# EAGLE design board (EAGLE 9.3.0)
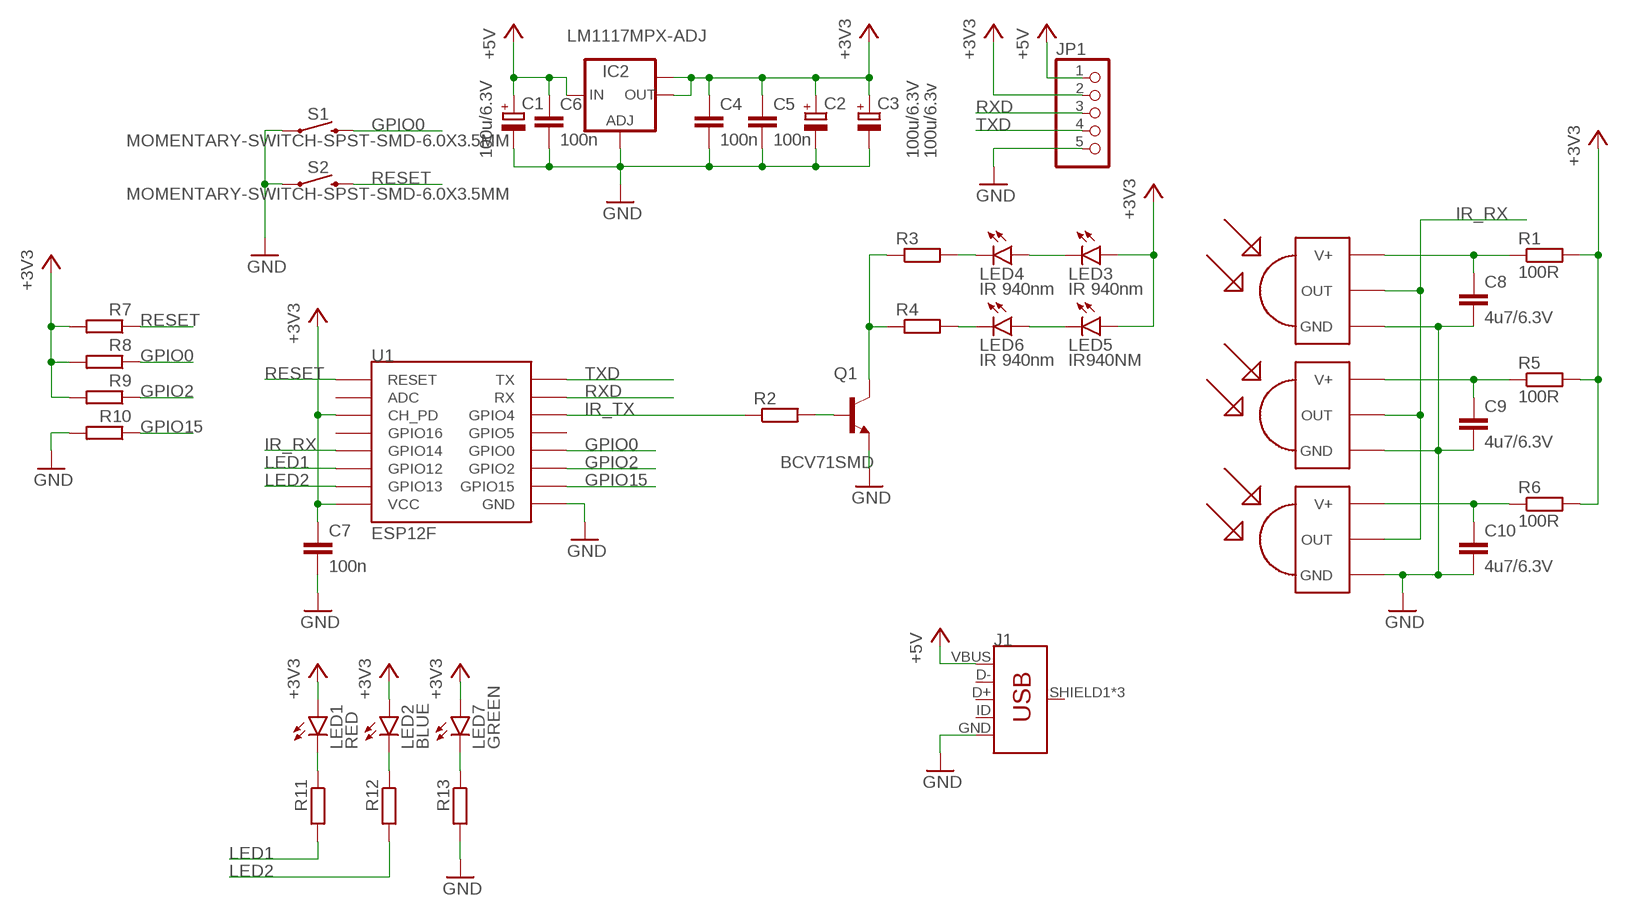
[diagram p0: schematic, sheet 1]

## Parts
C1  100u/6.3V  CPOL-EU153CLV-0605  [153CLV-0605]
C2  100u/6.3V  CPOL-EU153CLV-0605  [153CLV-0605]
C3  100u/6.3v  CPOL-EU153CLV-0605  [153CLV-0605]
C4  100n  C-EUC0805  [C0805]
C5  100n  C-EUC0805  [C0805]
C6  100n  C-EUC0805  [C0805]
C7  100n  C-EUC0805  [C0805]
C8  4u7/6.3V  C-EUC0805  [C0805]
C9  4u7/6.3V  C-EUC0805  [C0805]
C10  4u7/6.3V  C-EUC0805  [C0805]
IC2  LM1117MPX-ADJ  [SOT223]
J1  USB_MICRO-B_FEMALE-SMT  [USB-B-MICRO-SMD]
JP1  PINHD-1X5  [1X05]
LED1  RED  LEDCHIPLED_0805  [CHIPLED_0805]
LED2  BLUE  LEDCHIPLED_0805  [CHIPLED_0805]
LED3  IR 940nm  LED5MM  [LED5MM]
LED4  IR 940nm  LED5MM  [LED5MM]
LED5  IR940NM  LED5MM  [LED5MM]
LED6  IR 940nm  LED5MM  [LED5MM]
LED7  GREEN  LEDCHIPLED_0805  [CHIPLED_0805]
Q1  BCV71SMD  [SOT23-BEC]
R1  100R  R-EU_M0805  [M0805]
R2  R-EU_M0805  [M0805]
R3  R-EU_M0805  [M0805]
R4  R-EU_M0805  [M0805]
R5  100R  R-EU_M0805  [M0805]
R6  100R  R-EU_M0805  [M0805]
R7  R-EU_M0805  [M0805]
R8  R-EU_M0805  [M0805]
R9  R-EU_M0805  [M0805]
R10  R-EU_M0805  [M0805]
R11  R-EU_M0805  [M0805]
R12  R-EU_M0805  [M0805]
R13  R-EU_M0805  [M0805]
S1  MOMENTARY-SWITCH-SPST-SMD-6.0X3.5MM  [TACTILE_SWITCH_SMD_6.0X3.5MM]
S2  MOMENTARY-SWITCH-SPST-SMD-6.0X3.5MM  [TACTILE_SWITCH_SMD_6.0X3.5MM]
U1  ESP12F  ESP12SMD  [ESP12-SMD]
U$1  TSOP4838  [TSOP18XX]
U$2  TSOP4838  [TSOP18XX]
U$3  TSOP4838  [TSOP18XX]

## Nets
+3V3: C2.+ C3.+ C4.1 C5.1 C7.1 IC2.2(OUT) IC2.TAB(OUT1) JP1.2 LED1.A LED2.A LED3.A LED5.A LED7.A R1.2 R5.2 R6.2 R7.2 R8.2 R9.2 U1.CH_PD U1.VCC
+5V: C1.+ C6.1 IC2.3(IN) J1.VBUS JP1.1
GND: C1.- C2.- C3.- C4.2 C5.2 C6.2 C7.2 C8.2 C9.2 C10.2 IC2.1(ADJ) J1.GND JP1.5 Q1.E R10.2 R13.2 S1.1 S2.1 U1.GND U$1.GND U$2.GND U$3.GND
GPIO0: R8.1 S1.2 U1.GPIO0
GPIO2: R9.1 U1.GPIO2
GPIO15: R10.1 U1.GPIO15
IR_RX: U1.GPIO14 U$1.OUT U$2.OUT U$3.OUT
IR_TX: R2.1 U1.GPIO4
LED1: R11.2 U1.GPIO12
LED2: R12.2 U1.GPIO13
N$1: LED3.K(C) LED4.A
N$2: LED5.K(C) LED6.A
N$3: C9.1 R5.1 U$2.VCC(V+)
N$4: C8.1 R1.1 U$1.VCC(V+)
N$5: Q1.C R3.1 R4.1
N$6: C10.1 R6.1 U$3.VCC(V+)
N$7: LED7.C R13.1
N$8: Q1.B R2.2
N$9: LED2.C R12.1
N$11: LED4.K(C) R3.2
N$12: LED6.K(C) R4.2
N$14: LED1.C R11.1
RESET: R7.1 S2.2 U1.RESET
RXD: JP1.3 U1.RXD0(RX)
TXD: JP1.4 U1.TXD0(TX)
Unconnected: J1.D+ J1.D- J1.ID J1.SHIELD1(SHIELD) J1.SHIELD2(SHIELD) J1.SHIELD3(SHIELD) U1.ADC U1.GPIO5 U1.GPIO16

## Library data of the parts
C1-C3 = rcl:CPOL-EU: POLARIZED CAPACITOR, European symbol; SPICEPREFIX: C
C4-C10 = rcl:C-EU: CAPACITOR, European symbol; SPICEPREFIX: C
IC2 = lm1117:LM1117MPX-ADJ
J1 = SparkFun-Connectors:USB_MICRO-B: USB Type Micro-B Connector Male/female and PTH/SMT variants SparkFun Products: SparkFun microB USB Breakout <https://www.sparkfun.com/products/12035> SparkFun USB microB Plug Breakout <https://www.sparkfun.com/products/10031> SparkFun ESP8266 Thing <https://www.sparkfun.com/products/13231>; PROD_ID: CONN-11752
JP1 = pinhead:PINHD-1X5: PIN HEADER
LED1-LED7 = led:LED: LED OSRAM: - CHIPLED LG R971, LG N971, LY N971, LG Q971, LY Q971, LO R971, LY R971 LH N974, LH R974 LS Q976, LO Q976, LY Q976 LO Q996 - Hyper CHIPLED LW Q18S LB Q993, LB Q99A, LB R99A - SideLED LS A670, LO A670, LY A670, LG A670, LP A670 LB A673, LV A673, LT A673, LW A673 LH A674 LY A675 LS A676, LA A676, LO A676, LY A676, LW A676 LS A679, LY A679, LG A679 - Hyper Micro SIDELED® LS Y876, LA Y876, LO Y876, LY Y876 LT Y87S - SmartLED LW L88C, LW L88S LB L89C, LB L89S, LG L890 LS L89K, LO L89K, LY L89K LS L896, LA L896, LO L896, LY L896 - TOPLED LS T670, LO T670, LY T670, LG T670, LP T670 LSG T670, LSP T670, LSY T670, LOP T670, LYG T670 LG T671, LOG T671, LSG T671 LB T673, LV T673, LT T673, LW T673 LH T674 LS T676, LA T676, LO T676, LY T676, LB T676, LH T676, LSB T676, LW T676 LB T67C, LV T67C, LT T67C, LS T67K, LO T67K, LY T67K, LW E67C LS E67B, LA E67B, LO E67B, LY E67B, LB E67C, LV E67C, LT E67C LW T67C LS T679, LY T679, LG T679 LS T770, LO T770, LY T770, LG T770, LP T770 LB T773, LV T773, LT T773, LW T773 LH T774 LS E675, LA E675, LY E675, LS T675 LS T776, LA T776, LO T776, LY T776, LB T776 LHGB T686 LT T68C, LB T68C - Hyper Mini TOPLED® LB M676 - Mini TOPLED Santana® LG M470 LS M47K, LO M47K, LY M47K Source: http://www.osram.convergy.de LUXEON: - LUMILED® LXK2-PW12-R00, LXK2-PW12-S00, LXK2-PW14-U00, LXK2-PW14-V00 LXK2-PM12-R00, LXK2-PM12-S00, LXK2-PM14-U00 LXK2-PE12-Q00, LXK2-PE12-R00, LXK2-PE12-S00, LXK2-PE14-T00, LXK2-PE14-U00 LXK2-PB12-K00, LXK2-PB12-L00, LXK2-PB12-M00, LXK2-PB14-N00, LXK2-PB14-P00, LXK2-PB14-Q00 LXK2-PR12-L00, LXK2-PR12-M00, LXK2-PR14-Q00, LXK2-PR14-R00 LXK2-PD12-Q00, LXK2-PD12-R00, LXK2-PD12-S00 LXK2-PH12-R00, LXK2-PH12-S00 LXK2-PL12-P00, LXK2-PL12-Q00, LXK2-PL12-R00 Source: www.luxeon.com KINGBRIGHT: KA-3528ASYC Source: www.kingbright.com
Q1 = transistor-npn:BCV71*: NPN Transistor
R1-R13 = rcl:R-EU_: RESISTOR, European symbol; SPICEPREFIX: R
S1 S2 = SparkFun-Switches:MOMENTARY-SWITCH-SPST: Momentary Switch (Pushbutton) - SPST Normally-open (NO) SPST momentary switches (buttons, pushbuttons). Variants PTH-12MM - 12mm square, through-hole Momentary Pushbutton Switch - 12mm Square <https://www.sparkfun.com/products/9190> (COM-09190) PTH-6.0MM, PTH-6.0MM-KIT - 6.0mm square, through-hole Mini Pushbutton Switch <https://www.sparkfun.com/products/97> (COM-00097) KIT package intended for soldering kit's - only one side of pads' copper is exposed. PTH-RIGHT-ANGLE-KIT - Right-angle, through-hole Right Angle Tactile Button <https://www.sparkfun.com/products/10791> - Used on SparkFun BigTime Watch Kit <https://www.sparkfun.com/products/11734> SMD-12MM - 12mm square, surface-mount Tactile Button - SMD (12mm) <https://www.sparkfun.com/products/12993> (COM-12993) Used on SparkFun PicoBoard <https://www.sparkfun.com/products/11888> SMD-4.5MM - 4.5mm Square Trackball Switch Used on SparkFun Blackberry Trackballer Breakout <https://www.sparkfun.com/products/13169> SMD-4.6MMX2.8MM - 4.60mm x 2.80mm, surface mount Used on SparkFun SAMD21 Mini Breakout <https://www.sparkfun.com/products/13664> SMD-5.2MM, SMD-5.2-REDUNDANT - 5.2mm square, surface-mount Mini Pushbutton Switch - SMD <https://www.sparkfun.com/products/8720> (COM-08720) Used on Arduino Pro Mini <https://www.sparkfun.com/products/11114> REDUNDANT package connects both switch circuits together SMD-6.0X3.5MM - 6.0 x 3.5mm, surface mount Momentary Reset Switch SMD <https://www.sparkfun.com/products/8229> (COM-08229) SMD-6.2MM-TALL - 6.2mm square, surface mount Tactile Button - SMD (6mm) <https://www.sparkfun.com/products/12992> Used on SparkFun Digital Sandbox <https://www.sparkfun.com/products/12651> SMD-RIGHT-ANGLE - Right-angle, surface mount Used on SparkFun Block for Intel® Edison - Arduino <https://www.sparkfun.com/products/13036>; PROD_ID: SWCH-00815; SF_SKU: COM-08229
U1 = esp8266modules:ESP12: ESP8266 Wifi module 12
U$1-U$3 = tsop:TSOP4838: IR Receiver and Demodulator

## Board
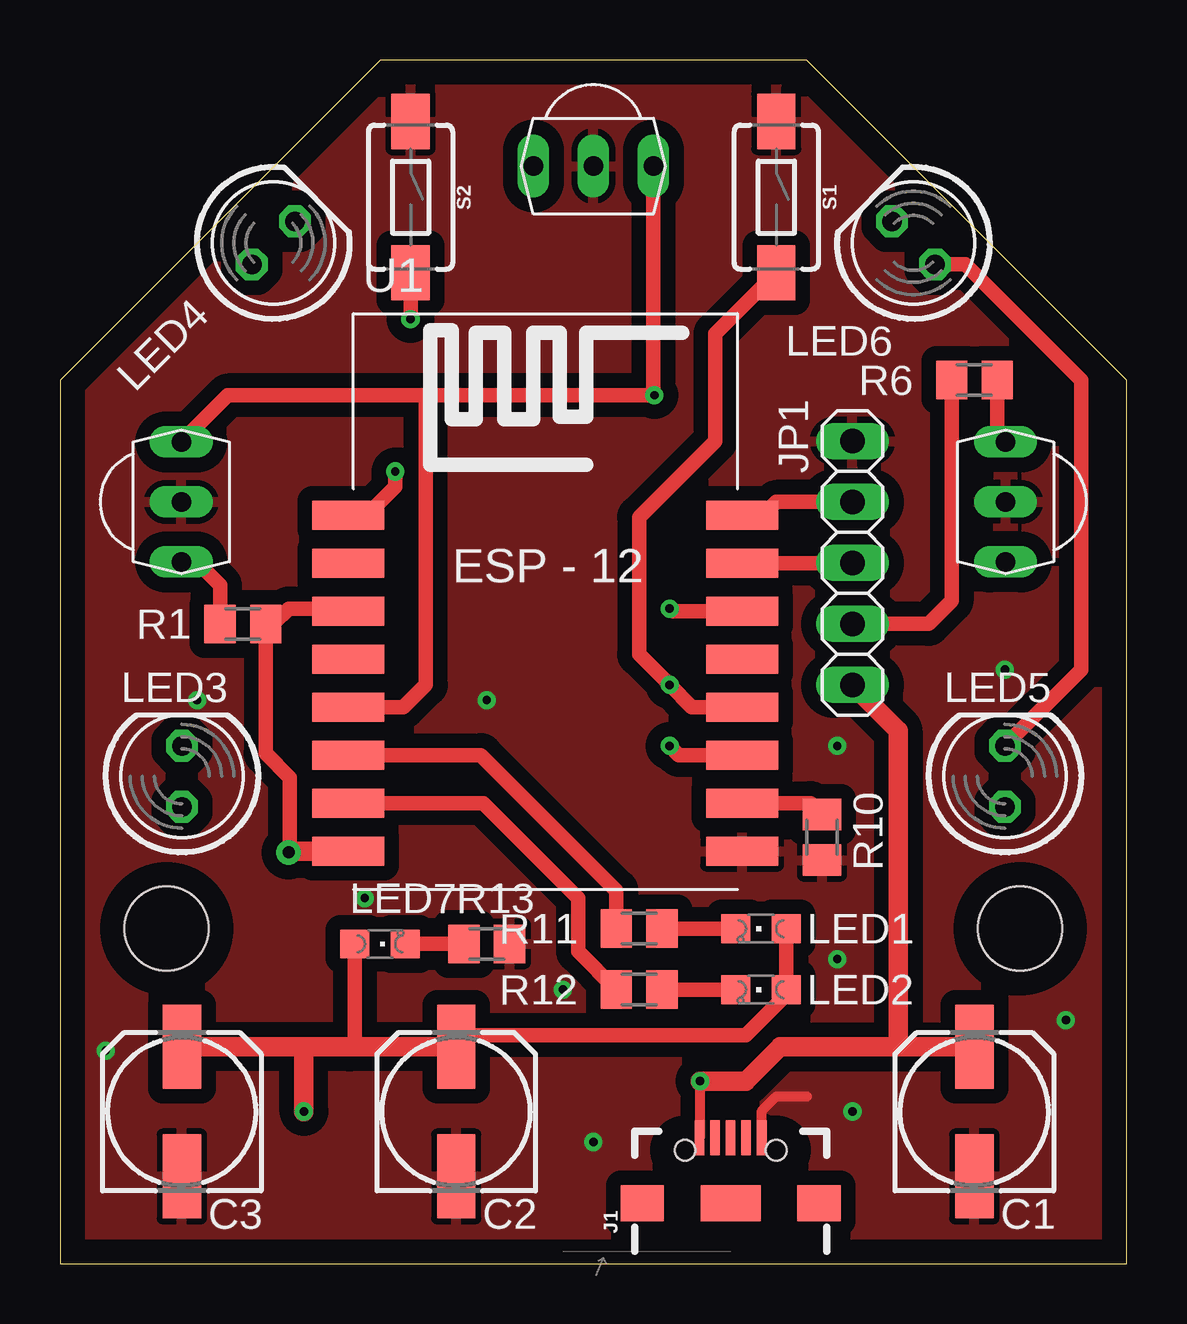
[diagram p1: board, top side]
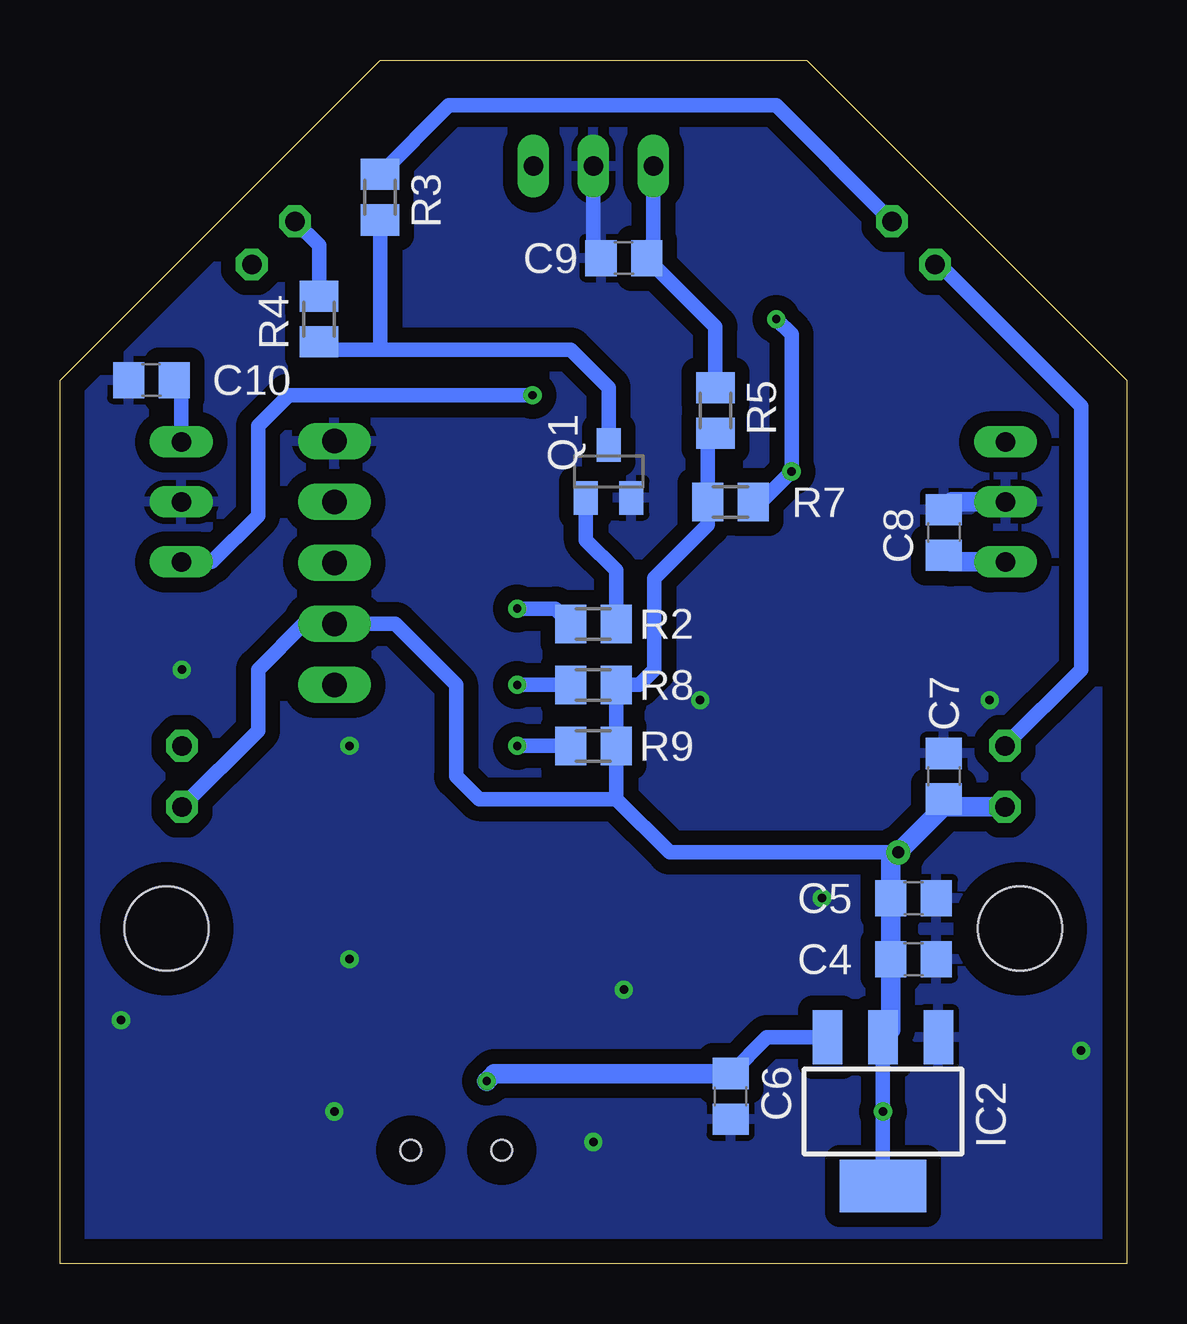
[diagram p2: board, bottom side, seen from below]

Size 44.45 x 50.16 mm. Coordinates in mm from the lower left corner, seen from the top.
Outline: 0,0 44.45,0 44.45,36.83 31.11,50.16 13.34,50.16 0,36.83 0,0
Copper layers (1*16): Top 0.0347mm / dielectric 1.5306mm / Bottom 0.0347mm
Design rules "AllPCB": minimum track width 6mil, minimum drill 0.3mm, track to track 6mil, track to pad 6mil, pad to pad 6mil, via to via 6mil, smd to smd 6mil, copper to edge 40mil, drill to drill 8mil, minimum pad ring 10mil, minimum via ring 8mil, stop-mask expansion 4mil, vias tented up to drill 0mil, thermal gap 10mil
Holes 3.5 mm at 4.45,13.97 40.01,13.97

### Footprints (pad centres in the part's own frame; a part is rotated, then mirrored left to right if it is on the bottom)
153CLV-0605 = smd 3.5 x 1.6: + 2.7,0; - -2.7,0
C0805 = smd 1.3 x 1.5: 1 -0.95,0; 2 0.95,0
SOT223 = smd 1.219 x 2.235: 1 -2.311,-3.099; 2 0,-3.099; 3 2.311,-3.099 | smd 3.6 x 2.2: TAB 0,3.099
USB-B-MICRO-SMD = smd 1.45 x 0.4: D+ 2.725,0; D- 2.725,0.65; GND 2.725,-1.3; ID 2.725,-0.65; VBUS 2.725,1.3 | smd 1.5 x 1.8: SHIELD1 0,3.685; SHIELD2 0,-3.685 | smd 1.5 x 2.5: SHIELD3 0,0 | hole 0.85: 2.2,1.9; 2.2,-1.9
1X05 = drill 1.016 long: 1 -5.08,0; 2 -2.54,0; 3 0,0; 4 2.54,0; 5 5.08,0
CHIPLED_0805 = smd 1.2 x 1.2: A 0,-1.05; C 0,1.05
LED5MM = drill 0.813 octagon: A -1.27,0; K 1.27,0
SOT23-BEC = smd 1 x 1.4: B -0.95,-1.1; C 0,1.1; E 0.95,-1.1
M0805 = smd 1.3 x 1.6: 1 -0.95,0; 2 0.95,0
TACTILE_SWITCH_SMD_6.0X3.5MM = smd 2.3 x 1.6: 1 -3.15,0; 2 3.15,0
ESP12-SMD = smd 3 x 1.2: ADC -8.3,3.8; CH_PD -8.3,1.8; GND 8.1,-8.2; GPIO0 8.1,-2.2; GPIO2 8.1,-4.2; GPIO4 8.1,1.8; GPIO5 8.1,-0.2; GPIO12 -8.3,-4.2; GPIO13 -8.3,-6.2; GPIO14 -8.3,-2.2; GPIO15 8.1,-6.2; GPIO16 -8.3,-0.2; RESET -8.3,5.8; RXD0 8.1,3.8; TXD0 8.1,5.8; VCC -8.3,-8.2
TSOP18XX = drill 0.813 long: GND -0.001,-0.027; OUT -2.501,-0.027; VCC 2.499,-0.027

### Placement (x,y rotation side)
C1  38.1,6.35 90 top
C2  16.51,6.35 90 top
C3  5.08,6.35 90 top
C4  8.89,12.7 0 bottom
C5  8.89,15.24 0 bottom
C6  16.51,6.99 270 bottom
C7  7.62,20.32 90 bottom
C8  7.62,30.48 90 bottom
C9  20.95,41.91 180 bottom
C10  40.64,36.83 180 bottom
IC2  10.16,6.35 180 bottom
J1  27.94,2.54 90 top
JP1  33.02,29.21 90 top
LED1  29.21,13.97 90 top
LED2  29.21,11.43 90 top
LED3  5.08,20.32 90 top
LED4  8.89,42.54 45 top
LED5  39.37,20.32 90 top
LED6  35.56,42.54 135 top
LED7  13.34,13.34 270 top
Q1  21.59,33.02 0 bottom
R1  7.62,26.67 0 top
R2  22.23,26.67 0 bottom
R3  31.11,44.45 90 bottom
R4  33.66,39.37 90 bottom
R5  17.14,35.56 270 bottom
R6  38.1,36.83 180 top
R7  16.51,31.75 180 bottom
R8  22.23,24.13 0 bottom
R9  22.23,21.59 0 bottom
R10  31.75,17.78 270 top
R11  24.13,13.97 180 top
R12  24.13,11.43 180 top
R13  17.78,13.34 0 top
S1  29.84,44.45 270 top
S2  14.61,44.45 270 top
U1  20.32,25.4 0 top
U$1  5.08,31.75 270 top
U$2  22.23,45.72 180 top
U$3  39.37,31.75 90 top

### Tracks (layer width: path | path; a pad name or v marks a point on that pad's centre or on a via)
+3V3  (via drill 0.35, 0.5 pad 1.02)
  Top 0.61: v9.53,17.14 9.58,17.2 9.58,20.26 8.57,21.27 R1.2 8.89,26.67 9.53,27.3 11.91,27.3 U1.CH_PD | LED1.A LED2.A 30.26,11.21 28.57,9.53 16.98,9.53 C2.+ | R6.2 37.15,27.62 36.2,26.67 JP1.2 | LED7.A 12.29,9.27 12.06,9.05
  Top 0.813: U1.VCC 9.58,17.2 | C2.+ 12.06,9.05 10.16,9.05 | 10.16,9.05 C3.+ | v10.16,6.35 10.16,9.05
  Bottom 0.61: IC2.2 v10.16,6.35 IC2.TAB | 21.27,19.37 R9.2 R8.2 20.32,24.13 19.68,24.77 19.68,28.57 17.46,30.8 R7.2 17.46,34.29 R5.2 | v9.53,17.14 19.05,17.14 21.27,19.37 | 21.27,19.37 26.99,19.37 27.94,20.32 27.94,24.13 30.48,26.67 JP1.2 34.29,26.67 36.2,24.77 36.2,22.23 LED5.A
  Bottom 0.813: IC2.2 9.84,9.77 C4.1 C5.1 9.84,16.83 v9.53,17.14 7.62,19.05 | 7.62,19.05 LED3.A | C7.1 7.62,19.05
+5V  (via drill 0.35)
  Top 0.406: J1.VBUS 26.67,5.29 v26.67,7.62
  Top 0.813: JP1.1 34.92,22.23 34.92,9.05 | v26.67,7.62 28.57,7.62 30,9.05 34.92,9.05 | 34.92,9.05 C1.+
  Bottom 0.61: IC2.3 15,9.45 C6.1
  Bottom 0.813: C6.1 26.36,7.94 v26.67,7.62
GND  (via drill 0.35)
  Top 0.406: J1.GND 29.24,6.38 29.84,6.99 31.11,6.99
  Bottom 0.61: U$2.GND 22.23,42.23 C9.2
  Bottom 0.813: U$1.GND 7.3,31.75 C8.2
  other vias: 17.78,23.5 5.71,23.5 12.7,15.24 20.95,11.43 1.91,8.89 22.23,5.08 32.38,12.7 32.38,21.59 39.37,24.77 41.91,10.16 33.02,6.35
  pour Top (isolate 0.61): 0,50.16 44.45,50.16 44.45,-1.27 0,-1.27
  pour Bottom (isolate 0.61): 0,50.16 44.45,50.16 44.45,-1.27 0,-1.27
GPIO0  (via drill 0.35)
  Top 0.61: U1.GPIO0 26.33,23.2 v25.4,24.13 24.13,25.4 24.13,31.11 27.3,34.29 27.3,38.76 S1.2
  Bottom 0.61: v25.4,24.13 R8.1
GPIO2  (via drill 0.35)
  Top 0.61: U1.GPIO2 25.79,21.2 v25.4,21.59
  Bottom 0.61: v25.4,21.59 R9.1
GPIO15
  Top 0.61: U1.GPIO15 31.28,19.2 R10.1
IR_RX  (via drill 0.35)
  Top 0.61: U$1.OUT 7,36.2 15.24,36.2 | 15.24,36.2 v24.77,36.2 24.73,36.23 U$2.OUT | U1.GPIO14 14.31,23.2 15.24,24.13 15.24,36.2
  Bottom 0.61: U$3.OUT 38.13,29.25 36.2,31.18 36.2,34.92 34.92,36.2 v24.77,36.2
IR_TX  (via drill 0.35)
  Top 0.61: U1.GPIO4 25.5,27.2 v25.4,27.3
  Bottom 0.61: v25.4,27.3 23.81,27.3 R2.1
LED1
  Top 0.61: U1.GPIO12 17.54,21.2 23.18,15.55 R11.2
LED2
  Top 0.61: R12.2 21.59,13.02 21.59,15.24 17.63,19.2 U1.GPIO13
N$1
  Bottom 0.61: LED3.K 1.91,24.77 1.91,35.73 7.82,41.65 LED4.A
N$2
  Top 0.61: LED5.K 42.55,24.77 42.55,36.83 37.73,41.65 LED6.A
N$3
  Bottom 0.61: U$2.VCC 19.73,42.57 20,42.29 C9.1 17.14,39.05 R5.1
N$4
  Top 0.61: R1.1 6.67,28.27 5.69,29.25 U$1.VCC
  Bottom 0.813: U$1.VCC 7.34,29.25 C8.1
N$5
  Bottom 0.61: Q1.C 21.59,36.51 23.18,38.1 31.11,38.1 | 31.11,38.1 33.02,38.1 33.34,38.42 R4.1 | R3.1 31.11,38.1
N$6
  Top 0.61: R6.1 39.05,34.59 U$3.VCC
  Bottom 0.61: U$3.VCC 39.4,36.54 C10.1
N$7
  Top 0.61: LED7.C R13.1
N$8
  Bottom 0.61: R2.2 21.27,28.89 22.54,30.16 Q1.B
N$9
  Top 0.61: LED2.C R12.1
N$11
  Bottom 0.61: LED4.K 14.62,48.27 28.24,48.27 R3.2
N$12
  Bottom 0.61: R4.2 33.66,42.44 LED6.K
N$14
  Top 0.61: R11.1 LED1.C
RESET  (via drill 0.35)
  Top 0.61: S2.2 v14.61,39.37 | U1.RESET 12.79,31.2 13.97,32.38 v13.97,33.02
  Bottom 0.61: v14.61,39.37 13.97,38.73 v13.97,33.02 15.24,31.75 R7.1
RXD
  Top 0.61: U1.RXD0 JP1.3
TXD
  Top 0.61: JP1.4 29.84,31.75 29.21,31.11 28.5,31.11 U1.TXD0